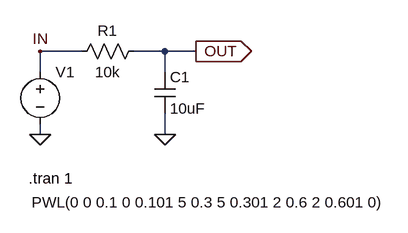
[diagram p0: schematic StepWave_LPF_EG.asc]
StepWave_LPF_EG.asc, the LTspice schematic file:
Version 4
SHEET 1 880 680
WIRE 208 96 144 96
WIRE 336 96 288 96
WIRE 384 96 336 96
WIRE 144 128 144 96
WIRE 336 128 336 96
WIRE 144 224 144 208
WIRE 336 224 336 192
FLAG 144 224 0
FLAG 336 224 0
FLAG 384 96 OUT
IOPIN 384 96 Out
FLAG 144 96 IN
SYMBOL voltage 144 112 R0
WINDOW 3 -13 217 Left 2
WINDOW 123 0 0 Left 2
WINDOW 39 0 0 Left 2
SYMATTR InstName V1
SYMATTR Value PWL(0 0 0.1 0 0.101 5 0.3 5 0.301 2 0.6 2 0.601 0)
SYMBOL res 304 80 R90
WINDOW 0 0 56 VBottom 2
WINDOW 3 32 56 VTop 2
SYMATTR InstName R1
SYMATTR Value 10k
SYMBOL cap 320 128 R0
SYMATTR InstName C1
SYMATTR Value 10uF
TEXT 126 292 Left 2 !.tran 1

The netlist it stands for:
* StepWave_LPF_EG.asc
V1 IN 0 PWL(0 0 0.1 0 0.101 5 0.3 5 0.301 2 0.6 2 0.601 0)
R1 OUT IN 10k
C1 OUT 0 10uF
.tran 1
.backanno
.end